# Altium schematic sheet Holoboard.SchDoc
size A4
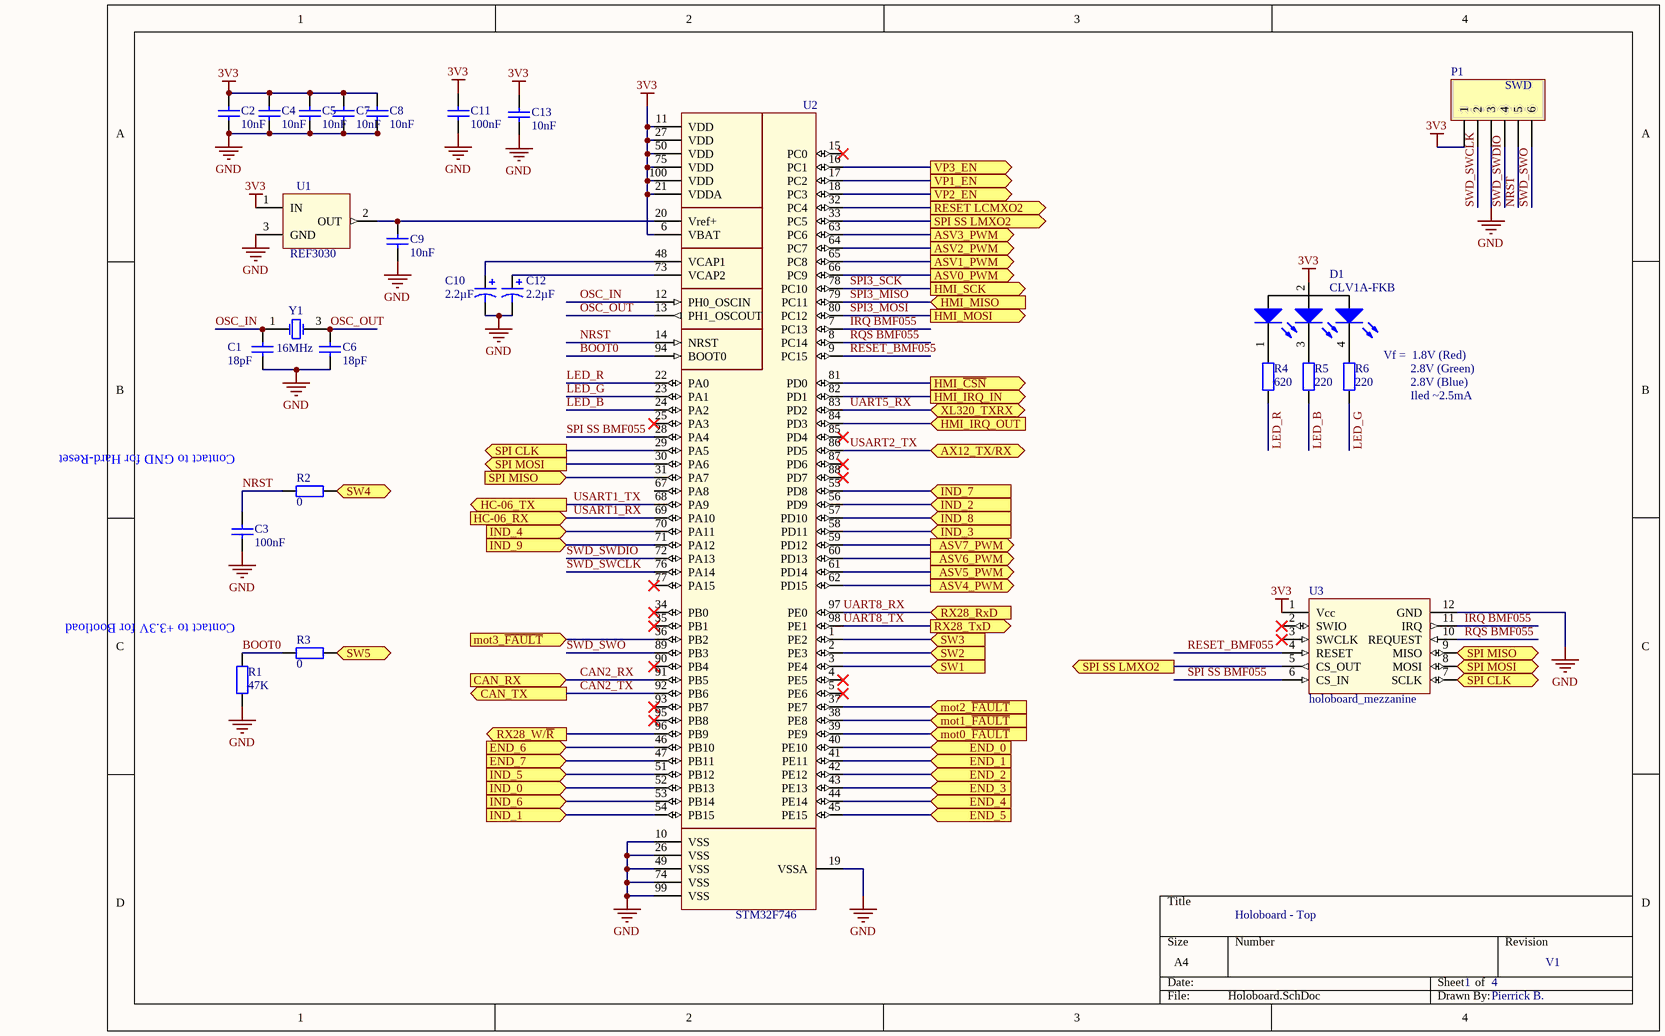
[diagram p0: Holoboard.SchDoc]

## Parts
C1  value 18pF  [C0603]  (hidden comment: Cap)
C2  value 10nF  [C0603]  (hidden comment: Cap)
C3  value 100nF  [C0603]  (hidden comment: Cap)
C4  value 10nF  [C0603]  (hidden comment: Cap)
C5  value 10nF  [C0603]  (hidden comment: Cap)
C6  value 18pF  [C0603]  (hidden comment: Cap)
C7  value 10nF  [C0603]  (hidden comment: Cap)
C8  value 10nF  [C0603]  (hidden comment: Cap)
C9  value 10nF  [C0603]  (hidden comment: Cap)
C10  value 2.2µF  [Boitier tantale A]  (hidden comment: Cap Pol)
C11  value 100nF  [C0603]  (hidden comment: Cap)
C12  value 2.2µF  [Boitier tantale A]  (hidden comment: Cap Pol)
C13  value 10nF  [C0603]  (hidden comment: Cap)
D1  CLV1A-FKB  [WL-SFTW SMD]
P1  SWD  [HDR1X6]
R1  value 47K  [0603]  (hidden comment: Res2)
R2  value 0  [0402]  (hidden comment: Res2)
R3  value 0  [0402]  (hidden comment: Res2)
R4  value 620  [0402]  (hidden comment: Res2)
R5  value 220  [0402]  (hidden comment: Res2)
R6  value 220  [0402]  (hidden comment: Res2)
U1  REF3030  [SOT-23]
U2  STM32F746  [LQFP100]
U3  holoboard_mezzanine  [holoboard_mezzanine]
Y1  16MHz  [QC3CA]

## Ports
ASV0_PWM (out), ASV1_PWM (out), ASV2_PWM (out), ASV3_PWM (out), ASV4_PWM (out), ASV5_PWM (out), ASV6_PWM (out), ASV7_PWM (out), AX12_TX/RX (bidir), CAN_RX (in), CAN_TX (out), END_0 (in), END_1 (in), END_2 (in), END_3 (in), END_4 (in), END_5 (in), END_6 (in), END_7 (in), HC-06_RX (in), HC-06_TX (out), HMI_IRQ_IN (out), HMI_IRQ_OUT (in), HMI_MISO (in), HMI_MOSI (out), HMI_SCK (out), HMI_~{CSN} (out), IND_0 (in), IND_1 (in), IND_2 (in), IND_3 (in), IND_4 (in), IND_5 (in), IND_6 (in), IND_7 (in), IND_8 (in), IND_9 (in), mot0_~{FAULT} (in), mot1_~{FAULT} (in), mot2_~{FAULT} (in), mot3_~{FAULT} (in), RESET LCMXO2 (out), RX28_RxD (in), RX28_TxD (out), RX28_W/~{R} (out), SPI CLK (in), SPI CLK (out), SPI MISO (in), SPI MISO (out), SPI MOSI (in), SPI MOSI (out), SPI SS LMXO2 (out), SW1 (in), SW2 (in), SW3 (in), SW4 (in), SW5 (in), VP1_EN (out), VP2_EN (out), VP3_EN (out), XL320_TXRX (bidir)

## Nets
3V3: C2.2 C4.2 C5.2 C7.2 C8.2 C11.2 C13.2 D1.2(A) P1.1 U1.1(IN) U2.6(VBAT) U2.11(VDD) U2.21(VDDA) U2.27(VDD) U2.50(VDD) U2.75(VDD) U2.100(VDD) U3.1(Vcc)
GND: C1.1 C2.1 C3.1 C4.1 C5.1 C6.1 C7.1 C8.1 C9.1 C10.2 C11.1 C12.2 C13.1 P1.3 R1.1 U1.3(GND) U2.10(VSS) U2.19(VSSA) U2.26(VSS) U2.49(VSS) U2.74(VSS) U2.99(VSS) U3.12(GND)
ASV0_PWM: U2.66(PC9) ; port ASV0_PWM
ASV1_PWM: U2.65(PC8) ; port ASV1_PWM
ASV2_PWM: U2.64(PC7) ; port ASV2_PWM
ASV3_PWM: U2.63(PC6) ; port ASV3_PWM
ASV4_PWM: U2.62(PD15) ; port ASV4_PWM
ASV5_PWM: U2.61(PD14) ; port ASV5_PWM
ASV6_PWM: U2.60(PD13) ; port ASV6_PWM
ASV7_PWM: U2.59(PD12) ; port ASV7_PWM
BOOT0: R1.2 R3.2 U2.94(BOOT0)
CAN2_RX: U2.91(PB5) ; port CAN_RX
CAN2_TX: U2.92(PB6) ; port CAN_TX
END_0: U2.40(PE10) ; port END_0
END_1: U2.41(PE11) ; port END_1
END_2: U2.42(PE12) ; port END_2
END_3: U2.43(PE13) ; port END_3
END_4: U2.44(PE14) ; port END_4
END_5: U2.45(PE15) ; port END_5
END_6: U2.46(PB10) ; port END_6
END_7: U2.47(PB11) ; port END_7
HMI_~{CSN}: U2.81(PD0) ; port HMI_~{CSN}
HMI_IRQ_IN: U2.82(PD1) ; port HMI_IRQ_IN
HMI_IRQ_OUT: U2.84(PD3) ; port HMI_IRQ_OUT
IND_0: U2.52(PB13) ; port IND_0
IND_1: U2.54(PB15) ; port IND_1
IND_2: U2.56(PD9) ; port IND_2
IND_3: U2.58(PD11) ; port IND_3
IND_4: U2.70(PA11) ; port IND_4
IND_5: U2.51(PB12) ; port IND_5
IND_6: U2.53(PB14) ; port IND_6
IND_7: U2.55(PD8) ; port IND_7
IND_8: U2.57(PD10) ; port IND_8
IND_9: U2.71(PA12) ; port IND_9
IRQ BMF055: U2.7(PC13) U3.11(IRQ)
LED_B: R5.1 U2.24(PA2)
LED_G: R6.1 U2.23(PA1)
LED_R: R4.2 U2.22(PA0)
mot0_~{FAULT}: U2.39(PE9) ; port mot0_~{FAULT}
mot1_~{FAULT}: U2.38(PE8) ; port mot1_~{FAULT}
mot2_~{FAULT}: U2.37(PE7) ; port mot2_~{FAULT}
mot3_~{FAULT}: U2.36(PB2) ; port mot3_~{FAULT}
NRST: C3.2 P1.5 R2.2 U2.14(NRST)
OSC_IN: C1.2 U2.12(PH0_OSCIN) Y1.1(OSC1)
OSC_OUT: C6.2 U2.13(PH1_OSCOUT) Y1.3(OSC2)
RESET LCMXO2: U2.32(PC4) ; port RESET LCMXO2
RESET_BMF055: U2.9(PC15) U3.4(RESET)
RQS BMF055: U2.8(PC14) U3.10(REQUEST)
RX28_W/~{R}: U2.96(PB9) ; port RX28_W/~{R}
SPI3_MISO: U2.79(PC11) ; port HMI_MISO
SPI3_MOSI: U2.80(PC12) ; port HMI_MOSI
SPI3_SCK: U2.78(PC10) ; port HMI_SCK
SPI CLK: U2.29(PA5) U3.7(SCLK) ; port SPI CLK
SPI MISO: U2.31(PA7) U3.9(MISO) ; port SPI MISO
SPI MOSI: U2.30(PA6) U3.8(MOSI) ; port SPI MOSI
SPI SS BMF055: U2.28(PA4) U3.6(CS_IN)
SPI SS LMXO2: U2.33(PC5) U3.5(CS_OUT) ; port SPI SS LMXO2
SW1: U2.3(PE4) ; port SW1
SW2: U2.2(PE3) ; port SW2
SW3: U2.1(PE2) ; port SW3
SW4: R2.1 ; port SW4
SW5: R3.1 ; port SW5
SWD_SWCLK: P1.2 U2.76(PA14)
SWD_SWDIO: P1.4 U2.72(PA13)
SWD_SWO: P1.6 U2.89(PB3)
UART5_RX: U2.83(PD2) ; port XL320_TXRX
UART8_RX: U2.97(PE0) ; port RX28_RxD
UART8_TX: U2.98(PE1) ; port RX28_TxD
USART1_RX: U2.69(PA10) ; port HC-06_RX
USART1_TX: U2.68(PA9) ; port HC-06_TX
USART2_TX: U2.86(PD5) ; port AX12_TX/RX
VP1_EN: U2.17(PC2) ; port VP1_EN
VP2_EN: U2.18(PC3) ; port VP2_EN
VP3_EN: U2.16(PC1) ; port VP3_EN
NetC9_2: C9.2 U1.2(OUT) U2.20(Vref+)
NetC10_1: C10.1 U2.48(VCAP1)
NetC12_1: C12.1 U2.73(VCAP2)
NetD1_1: D1.1(R) R4.1
NetD1_3: D1.3(B) R5.2
NetD1_4: D1.4(G) R6.2

Not connected (* = marked no-connect by the designer): U2 4(PE5)* 5(PE6)* 15(PC0)* 25(PA3)* 34(PB0)* 35(PB1)* 67(PA8) 77(PA15)* 85(PD4)* 87(PD6)* 88(PD7)* 90(PB4)* 93(PB7)* 95(PB8)*; U3 2(SWIO)* 3(SWCLK)*; Y1 2 4

## Notes on the sheet
- Vf =  1.8V (Red)
- 2.8V (Green)
- 2.8V (Blue)
- (near R2) Contact to GND for Hard-Reset
- Iled ~2.5mA
- Contact to +3.3V for Bootload
- Holoboard - Top
- 1
- 4
- V1
- Pierrick B.

## Library data of the parts
C1-C9 C11 C13 = Cap: Capacitor; Published: 8-Jun-2000; LatestRevisionDate: 17-Jul-2002; LatestRevisionNote: Re-released for DXP Platform.; PackageReference: RAD-0.3; Publisher: Altium Limited; Supplier: FARNELL
C10 C12 = Cap Pol: Polarized Capacitor; Published: 8-Jun-2000; LatestRevisionDate: 17-Jul-2002; LatestRevisionNote: Re-released for DXP Platform.; PackageReference: POLAR0.8; Publisher: Altium Limited; Supplier: FARNELL
P1 = Header 6: Header, 6-Pin; Supplie: FARNELL
R1-R6 = Res2: Resistor; Published: 8-Jun-2000; LatestRevisionDate: 17-Jul-2002; LatestRevisionNote: Re-released for DXP Platform.; PackageReference: AXIAL-0.4; Publisher: Altium Limited; Supplier: FARNELL
Y1 = XTAL_4pins: Crystal Oscillator; Published: 8-Jun-2000; LatestRevisionDate: 17-Jul-2002; LatestRevisionNote: Re-released for DXP Platform.; PackageReference: R38; Publisher: Altium Limited; Supplier: FARNELL